# Altium project PCB_Project1.PrjPCB
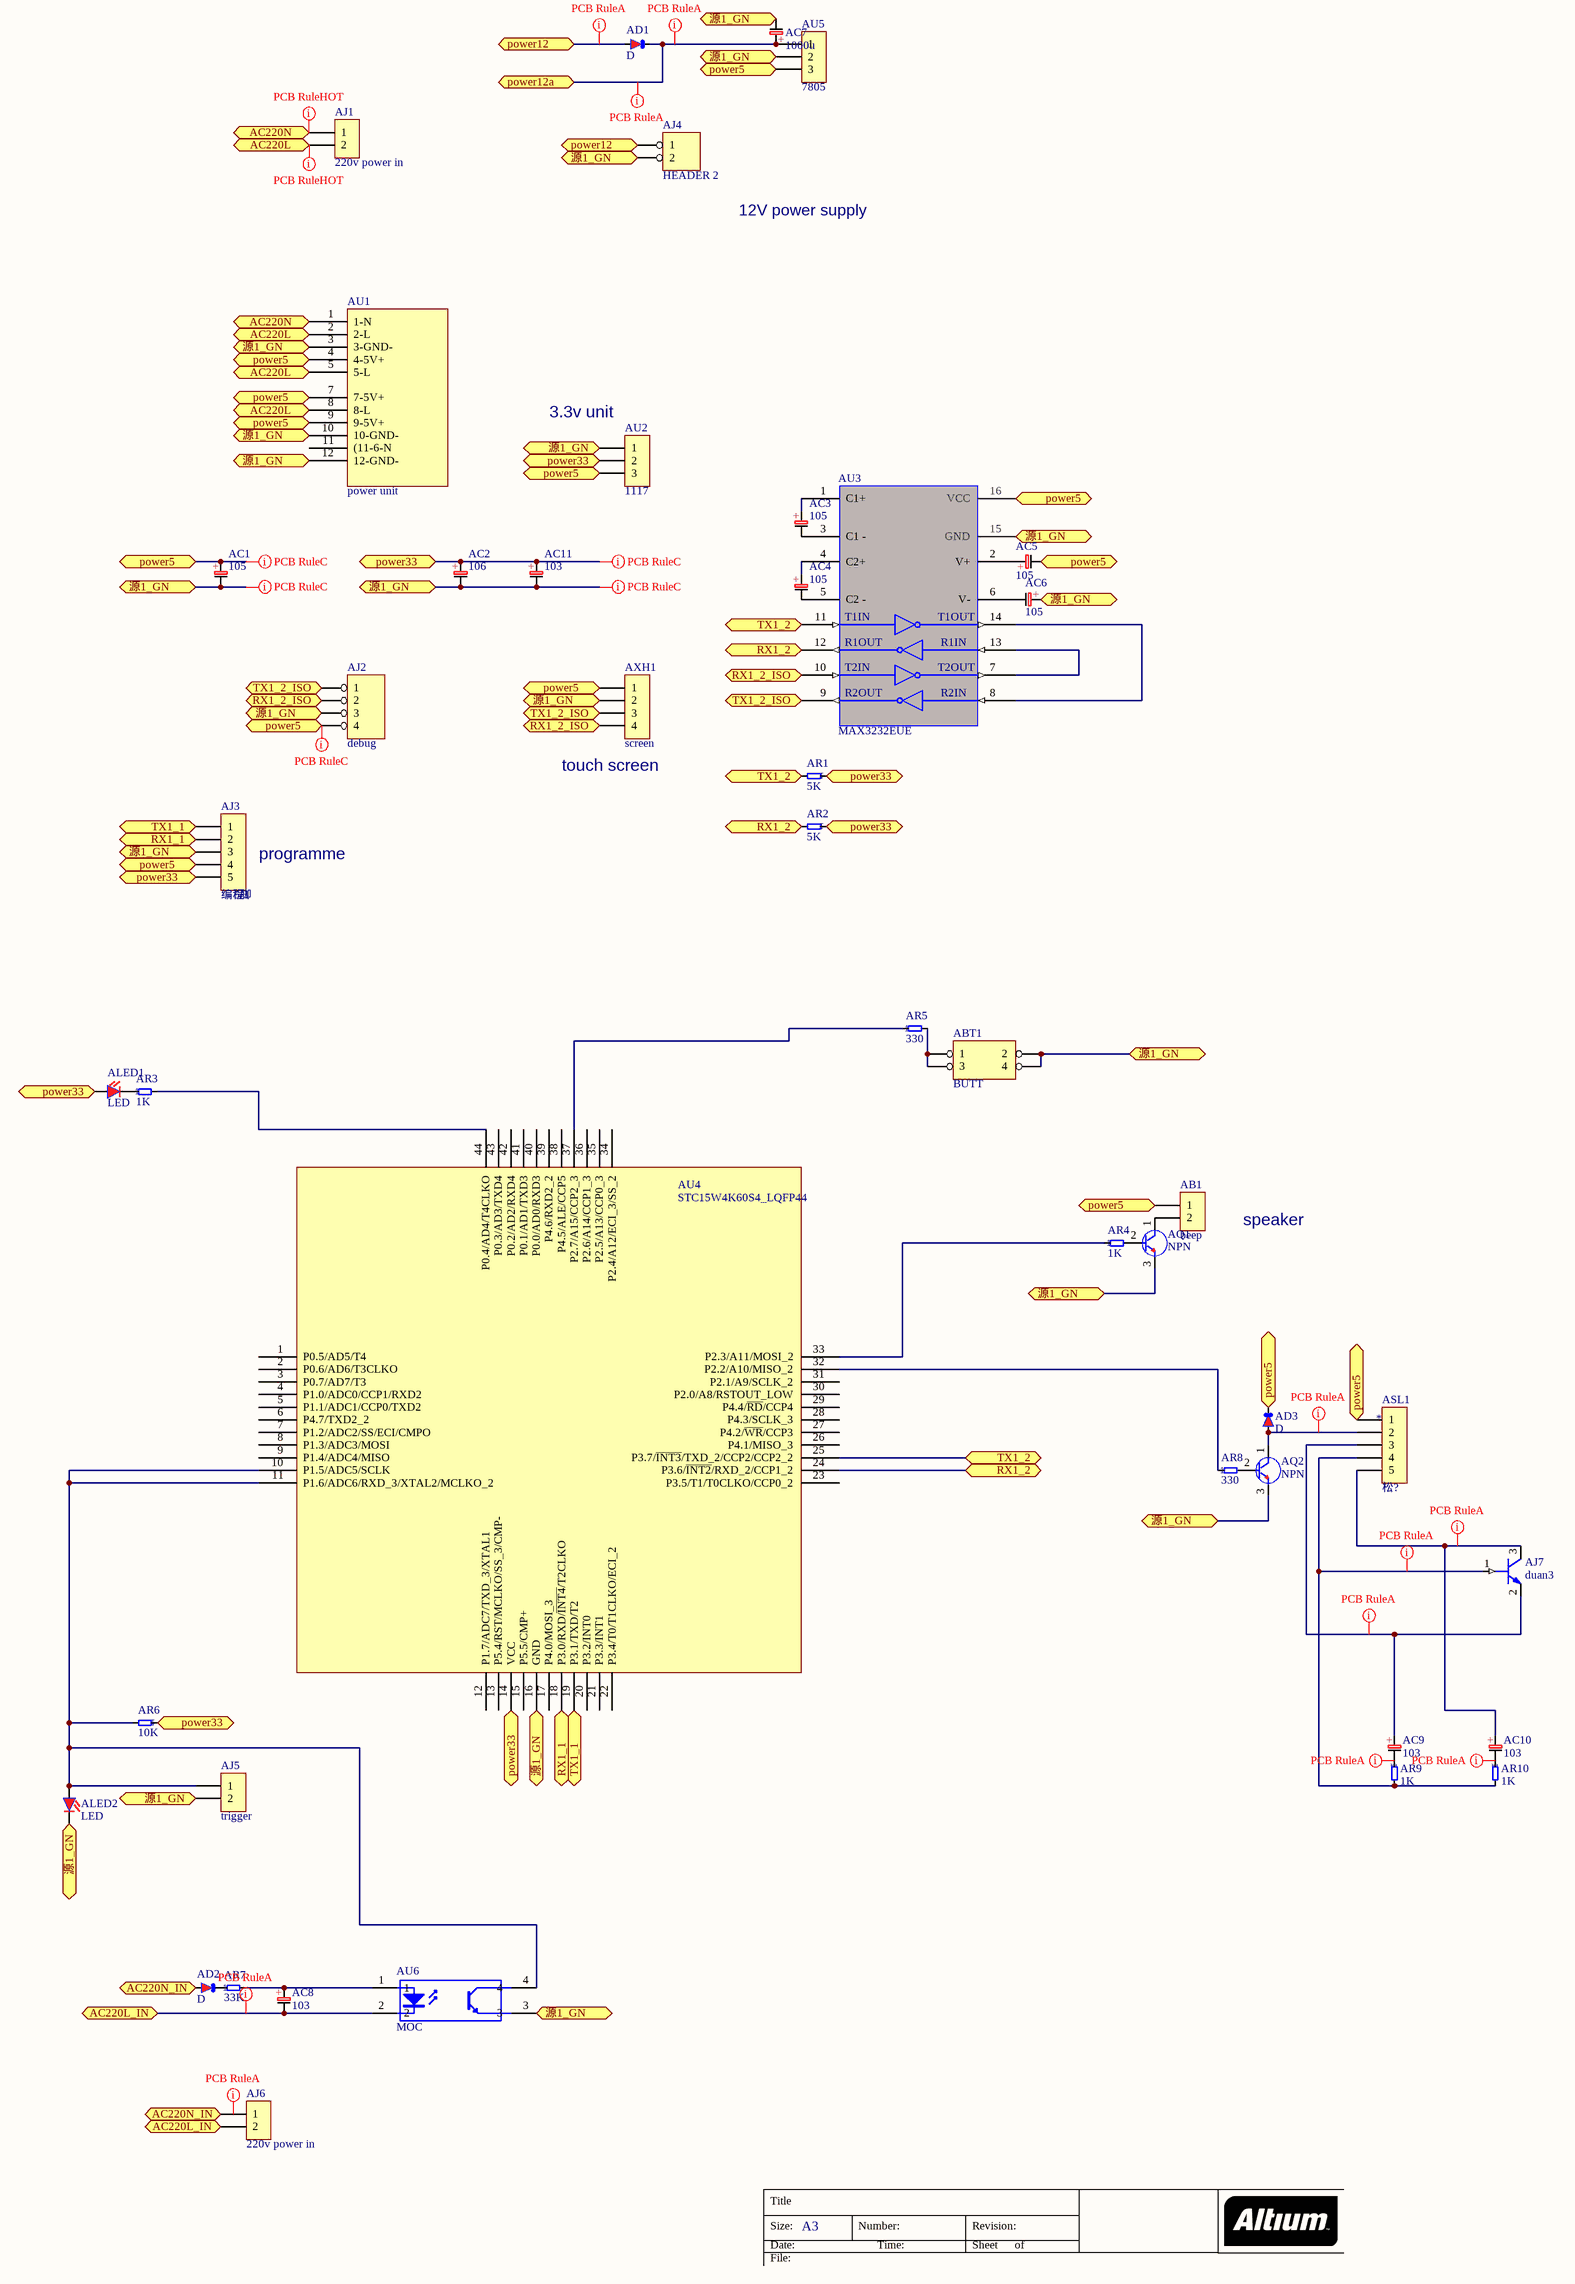
[diagram p0: Sheet1.SchDoc]
1 sheet, 45 parts. Net scope: flat (ports and power ports of the same name join across sheets).
Board file: PCB1.PcbDoc

## Sheet Sheet1.SchDoc
size A2 portrait; Organization: Altium Limited; Address1: L3, 12a Rodborough Rd; Address2: Frenchs Forest; Address3: NSW; Address4: Australia 2086

### Parts
AB1  beep  [BEEP_1]
ABT1  BUTT  [BUTT_01]
AC1  105  [CAP_10uF]
AC2  106  [CAP_10uF]
AC3  105  [cd_3mm]
AC4  105  [cd_3mm]
AC5  105  [cd_3mm]
AC6  105  [cd_3mm]
AC7  1000u  [CD-L_10]
AC8  103  [cd_5mm]
AC9  103  [cd_5mm]
AC10  103  [cd_5mm]
AC11  103  [cd_3mm]
AD1  D  [RESIST_1]
AD2  D  [RESIST_1]
AD3  D  [RESIST_1]
AJ1  220v power in  [DUAN5_2P]
AJ2  debug  [JP4_1]
AJ3  5脚  [CONN_PRG3]
AJ4  HEADER 2  [DUAN5_2P]
AJ5  trigger  [DUAN5_2P]
AJ6  220v power in  [DUAN5_2P]
AJ7  duan3  [DUAN5_3P]
ALED1  LED  [LED_1]
ALED2  LED  [cd_5mm]
AQ1  NPN  [TO-92_new1]
AQ2  NPN  [TO-92_new1]
AR1  5K  [LED0805]
AR2  5K  [LED0805]
AR3  1K  [LED0805]
AR4  1K  [LED0805]
AR5  330  [LED0805]
AR6  10K  [LED0805]
AR7  33K  [cd_5mm]
AR8  330  [LED0805]
AR9  1K  [cd_5mm]
AR10  1K  [cd_5mm]
ASL1  *  [SONGLE_1]
AU1  power unit  [POW220_5V_700]
AU2  1117  [SOT223_4N_1]
AU3  MAX3232EUE  [SOP16]
AU4  STC15W4K60S4_LQFP44  [LQFP44]
AU5  7805  [TO220_1]
AU6  MOC  [DIP4]
AXH1  screen  [XH_P4]

### Ports
AC220L, AC220L_IN, AC220N, AC220N_IN, power5, power12, power12a, power33, RX1_1, RX1_2, RX1_2_ISO, TX1_1, TX1_2, TX1_2_ISO, 源1_GN

### Nets
NetAB1_1: AB1.1 AC1.1 AC5.2 AD3.K AJ2.4 AJ3.4 ASL1.1 AU1.4(4-5V+) AU1.7(7-5V+) AU1.9(9-5V+) AU2.3 AU3.16(VCC) AU5.3 AXH1.1 ; port power5
NetAB1_2: AB1.2 AQ1.1(C)
NetABT1_1: ABT1.1 ABT1.3 AR5.2
NetABT1_2: ABT1.2 ABT1.4 AC1.2 AC2.2 AC6.1 AC7.2 AC11.2 AJ2.3 AJ3.3 AJ4.2 AJ5.2 ALED2.K(k) AQ1.3(E) AQ2.3(E) AU1.3(3-GND-) AU1.10(10-GND-) AU1.12(12-GND-) AU2.1 AU3.15(GND) AU4.16(GND) AU5.2 AU6.3 AXH1.2 ; port 源1_GN
NetAC2_1: AC2.1 AC11.1 AJ3.5 ALED1.A(a) AR1.1 AR2.1 AR6.1 AU2.2 AU4.14(VCC) ; port power33
NetAC3_1: AC3.1 AU3.1(C1+)
NetAC3_2: AC3.2 AU3.3(C1_-)
NetAC4_1: AC4.1 AU3.4(C2+)
NetAC4_2: AC4.2 AU3.5(C2_-)
NetAC5_1: AC5.1 AU3.2(V+)
NetAC6_2: AC6.2 AU3.6(V-)
NetAC7_1: AC7.1 AD1.K AU5.1 ; port power12a
NetAC8_1: AC8.1 AR7.2 AU6.1
NetAC8_2: AC8.2 AJ6.2 AU6.2 ; port AC220L_IN
NetAC9_1: AC9.1 AJ7.2(EMITTER) ASL1.3
NetAC9_2: AC9.2 AR9.1
NetAC10_1: AC10.1 AJ7.3(COLLECTOR) ASL1.5
NetAC10_2: AC10.2 AR10.1
NetAD1_A: AD1.A AJ4.1 ; port power12
NetAD2_A: AD2.A AJ6.1 ; port AC220N_IN
NetAD2_K: AD2.K AR7.1
NetAD3_A: AD3.A AQ2.1(C) ASL1.2
NetAJ1_1: AJ1.1 AU1.1(1-N) ; port AC220N
NetAJ1_2: AJ1.2 AU1.2(2-L) AU1.5(5-L) AU1.8(8-L) ; port AC220L
NetAJ2_1: AJ2.1 AU3.9(R2_OUT) AXH1.3 ; port TX1_2_ISO
NetAJ2_2: AJ2.2 AU3.10(T2_IN) AXH1.4 ; port RX1_2_ISO
NetAJ3_1: AJ3.1 AU4.19(P3.1/TXD/T2) ; port TX1_1
NetAJ3_2: AJ3.2 AU4.18(P3.0/RXD/~{INT4}/T2CLKO) ; port RX1_1
NetAJ5_1: AJ5.1 ALED2.A(a) AR6.2 AU4.10(P1.5/ADC5/SCLK) AU4.11(P1.6/ADC6/RXD_3/XTAL2/MCLKO_2) AU6.4
NetAJ7_1: AJ7.1(BASE) AR9.2 AR10.2 ASL1.4
NetALED1_K: ALED1.K(k) AR3.1
NetAQ1_2: AQ1.2(B) AR4.2
NetAQ2_2: AQ2.2(B) AR8.2
NetAR1_2: AR1.2 AU3.11(T1_IN) AU4.25(P3.7/~{INT3}/TXD_2/CCP2/CCP2_2) ; port TX1_2
NetAR2_2: AR2.2 AU3.12(R1_OUT) AU4.24(P3.6/~{INT2}/RXD_2/CCP1_2) ; port RX1_2
NetAR3_2: AR3.2 AU4.44(P0.4/AD4/T4CLKO)
NetAR4_1: AR4.1 AU4.33(P2.3/A11/MOSI_2)
NetAR5_1: AR5.1 AU4.37(P2.7/A15/CCP2_3)
NetAR8_1: AR8.1 AU4.32(P2.2/A10/MISO_2)
NetAU3_7: AU3.7(T2_OUT) AU3.13(R1_IN)
NetAU3_8: AU3.8(R2_IN) AU3.14(T1_OUT)

Not connected (* = marked no-connect by the designer): AU1 11((11-6-N); AU4 1(P0.5/AD5/T4) 2(P0.6/AD6/T3CLKO) 3(P0.7/AD7/T3) 4(P1.0/ADC0/CCP1/RXD2) 5(P1.1/ADC1/CCP0/TXD2) 6(P4.7/TXD2_2) 7(P1.2/ADC2/SS/ECI/CMPO) 8(P1.3/ADC3/MOSI) 9(P1.4/ADC4/MISO) 12(P1.7/ADC7/TXD_3/XTAL1) 13(P5.4/RST/MCLKO/SS_3/CMP-) 15(P5.5/CMP+) 17(P4.0/MOSI_3) 20(P3.2/INT0) 21(P3.3/INT1) 22(P3.4/T0/T1CLKO/ECI_2) 23(P3.5/T1/T0CLKO/CCP0_2) 26(P4.1/MISO_3) 27(P4.2/~{WR}/CCP3) 28(P4.3/SCLK_3) 29(P4.4/~{RD}/CCP4) 30(P2.0/A8/RSTOUT_LOW) 31(P2.1/A9/SCLK_2) 34(P2.4/A12/ECI_3/SS_2) 35(P2.5/A13/CCP0_3) 36(P2.6/A14/CCP1_3) 38(P4.5/ALE/CCP5) 39(P4.6/RXD2_2) 40(P0.0/AD0/RXD3) 41(P0.1/AD1/TXD3) 42(P0.2/AD2/RXD4) 43(P0.3/AD3/TXD4)

### Layout directives
rule Width Constraint [Pref Width = 22mil    Min Width = 16mil    Max Width = 22mil]: NetAB1_1, NetABT1_2, NetAC2_1
rule Width Constraint [Pref Width = 55mil    Min Width = 22mil    Max Width = 77mil]: NetAJ1_1, NetAJ1_2
rule Width Constraint [Pref Width = 33mil    Min Width = 16mil    Max Width = 55mil]: (no net found under the mark), NetAC7_1, NetAC8_2, NetAC9_1, NetAC9_2, NetAC10_1, NetAC10_2, NetAD1_A, NetAD3_A, NetAJ7_1

### Notes on the sheet
- 12V power supply
- (near AU2) 3.3v unit
- (near AXH1) touch screen
- (near AJ3) programme
- speaker
- Title
- Size:
- Date:
- A3
- Number:
- Time:
- Revision:
- Sheet
- of
- File:
- A2
- (in symbol C) 编程1
- (in symbol CD) +
- (in symbol CON5) 松?
- (in symbol MAX3) T1IN; T1OUT; R1OUT; R1IN; T2IN; T2OUT; R2OUT; R2IN

### Library data of the parts
AB1 AJ3 AU2 AU5 = C: Connector
ABT1 = HEA
AC1-AC11 = CD
AD1-AD3 = D: pin to pad: A>1 K>2
AJ1 AJ5 AJ6 = CON2: Connector
AJ2 = 4 HEADER: 4 Pin Header
AJ7 = 2N3904_0
ALED1 = L
ALED2 = L: pin to pad: A>1 K>2
AQ1 AQ2 = NPN_L1
AR1-AR10 = R
ASL1 = CON5: Connector
AU1 = PO: 电源模块-多引脚
AU3 = MAX3: Maxim ±15kV ESD-Protected,Up to 1Mbps,3.3V,True RS-232 Transceivers,TSSOP16 Package,-40-85°C; Manufacturer: Maxim-Dallas; Code-JEDEC: MO-153; Code-IEC: *; ComponentLinkDescription: *; ComponentLinkURL: http://www.maxim-ic.com; DatasheetVersion: 01/2006; PackageDescription: TSSOP, 16-Leads, Body 5x4.4mm, Pitch 0.65mm; PackageReference: *; PackageVersion: *; Published: *; Publisher: *
AU6 = EL817
AXH1 = CON4: Connector